# EAGLE design OSO-MISC-21-012 Sensor Watch Testpoints v2 (EAGLE 9.6.2)
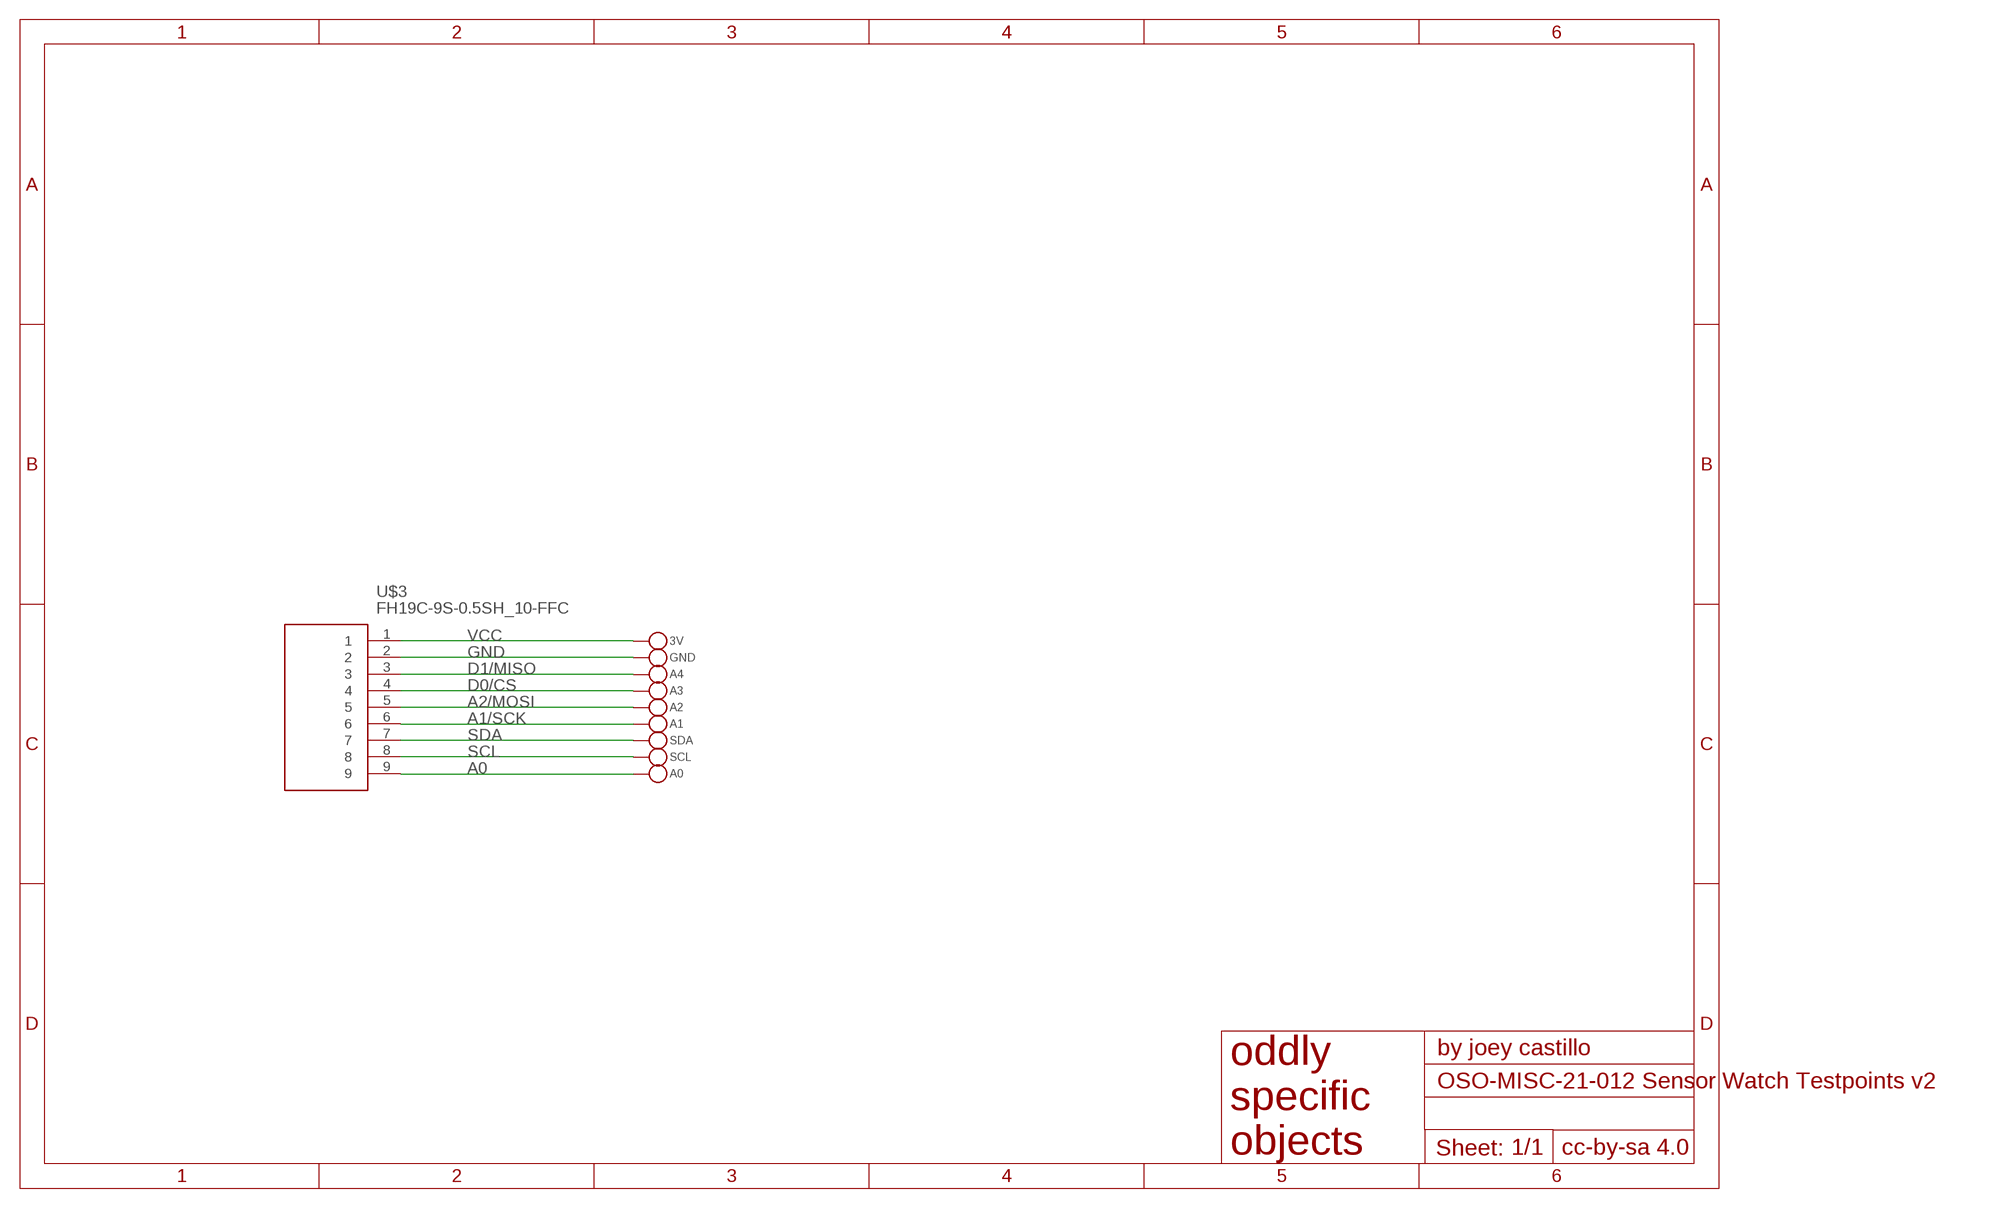
[diagram p0: schematic, sheet 1]

## Parts
3V  MICROBUILDER_TESTPOINT1.5X2.0MM_NOCREAM  [MICROBUILDER_PAD-1.5X2.0]
A0  MICROBUILDER_TESTPOINT1.5X2.0MM_NOCREAM  [MICROBUILDER_PAD-1.5X2.0]
A1  MICROBUILDER_TESTPOINT1.5X2.0MM_NOCREAM  [MICROBUILDER_PAD-1.5X2.0]
A2  MICROBUILDER_TESTPOINT1.5X2.0MM_NOCREAM  [MICROBUILDER_PAD-1.5X2.0]
A3  MICROBUILDER_TESTPOINT1.5X2.0MM_NOCREAM  [MICROBUILDER_PAD-1.5X2.0]
A4  MICROBUILDER_TESTPOINT1.5X2.0MM_NOCREAM  [MICROBUILDER_PAD-1.5X2.0]
GND  MICROBUILDER_TESTPOINT1.5X2.0MM_NOCREAM  [MICROBUILDER_PAD-1.5X2.0]
SCL  MICROBUILDER_TESTPOINT1.5X2.0MM_NOCREAM  [MICROBUILDER_PAD-1.5X2.0]
SDA  MICROBUILDER_TESTPOINT1.5X2.0MM_NOCREAM  [MICROBUILDER_PAD-1.5X2.0]
U$3  FH19C-9S-0.5SH_10-FFC  [FH19C9S05SH10-FFC]

## Nets
A0: A0.P$1 U$3.9
A1/SCK: A1.P$1 U$3.6
A2/MOSI: A2.P$1 U$3.5
D0/CS: A3.P$1 U$3.4
D1/MISO: A4.P$1 U$3.3
GND [power]: GND.P$1 U$3.2
SCL: SCL.P$1 U$3.8
SDA: SDA.P$1 U$3.7
VCC [power]: 3V.P$1 U$3.1

## Library data of the parts
3V A0 A1-A4 GND SCL SDA = Adafruit Feather M0 Express:MICROBUILDER_TESTPOINT: Test Point Various test points for characterisation and PCB testing TESTPOINT_SMT - Compact Surface Mount Test Point [Digikey: 5016KTR-ND]
U$3 = FH19C-9S-0.5SH:FH19C-9S-0.5SH_10-FFC

## Net classes
1 power: width 0.254 mm

## Board
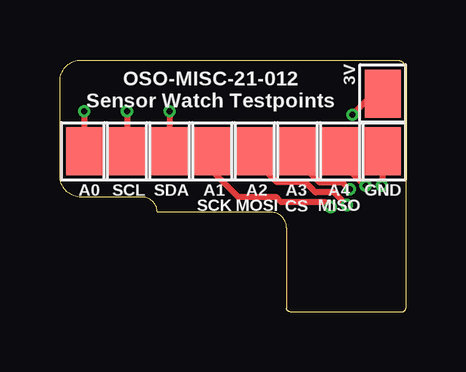
[diagram p1: board, top side]
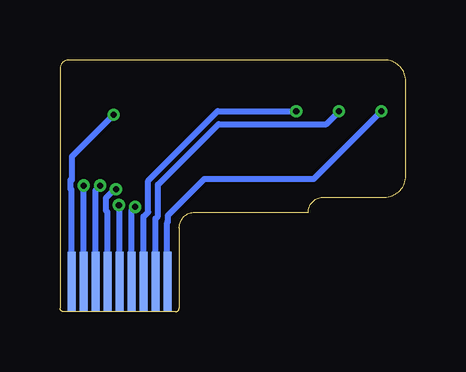
[diagram p2: board, bottom side, seen from below]

Size 14.43 x 10.48 mm. Coordinates in mm from the lower left corner, seen from the top.
Outline: 9.45,3.5 arc90 8.81,4.14 4.06,4.14 arc90 3.43,4.77 0.89,4.77 arc-90 0,5.66 0,9.6 arc-90 0.89,10.48 14.05,10.48 arc-90 14.43,10.1 14.43,3.5
Copper layers (1*16): Top 0.035559375mm / dielectric 4mil / Bottom 0.035559375mm
Design rules "oshpark-2layer *": minimum track width 6mil, minimum drill 10mil, track to track 6mil, track to pad 6mil, pad to pad 6mil, via to via 6mil, smd to smd 6mil, copper to edge 15mil, drill to drill 6mil, minimum pad ring 5mil, minimum via ring 5mil, stop-mask expansion 2.5mil, vias tented up to drill 12mil, thermal gap 10mil

### Footprints (pad centres in the part's own frame; a part is rotated, then mirrored left to right if it is on the bottom)
MICROBUILDER_PAD-1.5X2.0 = smd 1.5 x 2: P$1 0,0
FH19C9S05SH10-FFC = smd 0.347 x 2.5 bottom: 1 2,-2.25; 2 1.5,-2.25; 3 1,-2.25; 4 0.5,-2.25; 5 0,-2.25; 6 -0.5,-2.25; 7 -1,-2.25; 8 -1.5,-2.25; 9 -2,-2.25

### Placement (x,y rotation side)
3V  13.46,9.09 180 top
A0  1.02,6.68 0 top
A1  6.35,6.68 0 top
A2  8.13,6.68 0 top
A3  9.91,6.68 0 top
A4  11.68,6.68 0 top
GND  13.46,6.68 0 top
SCL  2.79,6.68 0 top
SDA  4.57,6.68 0 top
U$3  11.94,3.5 0 top

### Tracks (layer width: path | path; a pad name or v marks a point on that pad's centre or on a via)
A0  (via drill 0.25)
  Top 0.254: v1.02,8.35 A0.P$1
  Bottom 0.254: U$3.9 9.96,1.27 9.96,3.71 9.93,3.73 9.92,3.8 9.92,4.01 8.4,5.53 3.84,5.53 v1.02,8.35
A1/SCK  (via drill 0.25)
  Top 0.254: v11.29,4.36 11.09,4.57 9.23,4.57 9.02,4.77 7.46,4.77 6.35,5.88 A1.P$1
  Bottom 0.254: U$3.6 11.44,4.22 v11.29,4.36
A2/MOSI  (via drill 0.25)
  Top 0.254: v11.97,4.44 11.44,4.97 10.67,4.97 10.24,5.4 9.04,5.4 8.13,6.31 A2.P$1
  Bottom 0.254: U$3.5 11.94,4.41 v11.97,4.44
D0/CS  (via drill 0.25)
  Top 0.254: A3.P$1 9.91,6.31 10.83,5.38 11.81,5.38 v12.09,5.1
  Bottom 0.254: U$3.4 12.44,4.15 12.51,4.22 12.51,4.73 12.14,5.1 v12.09,5.1
D1/MISO  (via drill 0.25)
  Top 0.254: v12.75,5.25 12.72,5.25 11.68,6.29 A4.P$1
  Bottom 0.254: U$3.3 12.94,5.04 12.75,5.23 v12.75,5.25
GND  (via drill 0.25)
  Top 0.254: v13.43,5.25 13.46,5.28 GND.P$1
  Bottom 0.254: U$3.2 v13.44,5.25 v13.43,5.25
SCL  (via drill 0.25)
  Top 0.254: v2.79,8.35 SCL.P$1
  Bottom 0.254: U$3.8 10.44,3.88 10.34,3.98 10.34,5.29 7.81,7.82 3.31,7.82 2.79,8.33 v2.79,8.35
SDA  (via drill 0.25)
  Top 0.254: v4.57,8.35 SDA.P$1
  Bottom 0.254: U$3.7 10.94,3.95 10.74,4.15 10.74,5.46 7.85,8.35 v4.57,8.35
VCC  (via drill 0.25)
  Top 0.254: v12.19,8.2 13.08,9.09 3V.P$1
  Bottom 0.254: U$3.1 13.94,5.06 13.99,5.11 13.99,5.48 13.92,5.48 13.92,6.47 v12.19,8.2

### Text on the board
tPlace: OSO-MISC-21-012 / Sensor Watch Testpoints | SCK | MOSI | CS | MISO